# EAGLE design SparkFun_Color_Sensor_OPT4048 (EAGLE 9.6.2)
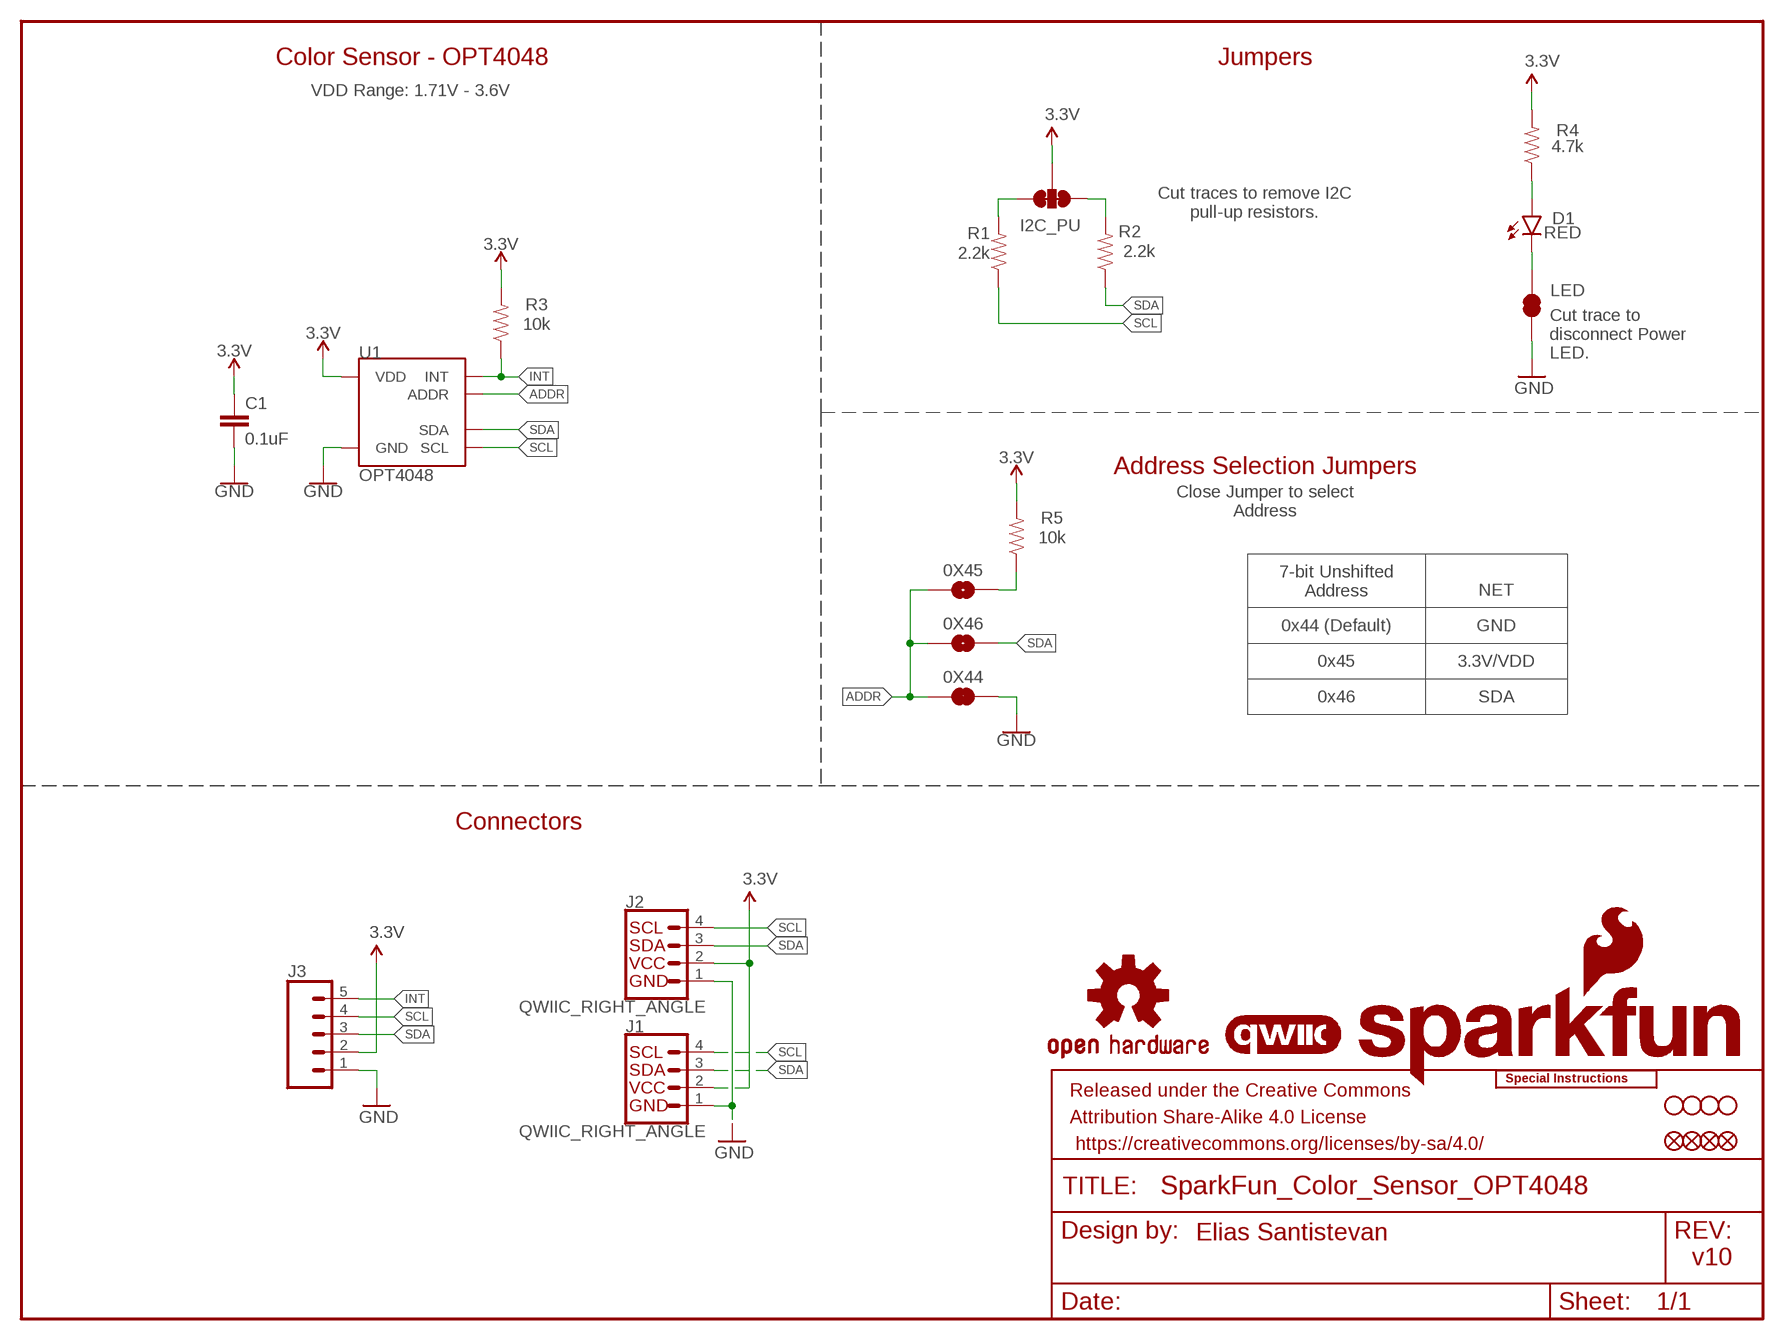
[diagram p0: schematic, sheet 1]

## Parts
0X44  JUMPER-SMT_2_NC_TRACE_SILK  [SMT-JUMPER_2_NC_TRACE_SILK]
0X45  JUMPER-SMT_2_NO_SILK  [SMT-JUMPER_2_NO_SILK]
0X46  JUMPER-SMT_2_NO_SILK  [SMT-JUMPER_2_NO_SILK]
C1  0.1uF  0.1UF-0402T-16V-10%  [0402-TIGHT]
D1  RED  LED-RED_0603-KB  [LED-0603]
FD1  FIDUCIALUFIDUCIAL  [FIDUCIAL-MICRO]
FD2  FIDUCIALUFIDUCIAL  [FIDUCIAL-MICRO]
FID1  FIDUCIALUFIDUCIAL  [FIDUCIAL-MICRO]
FID2  FIDUCIALUFIDUCIAL  [FIDUCIAL-MICRO]
FRAME1  FRAME-LETTER  [CREATIVE_COMMONS]
I2C_PU  S_MODE  JUMPER-SMT_3_2-NC_TRACE_SILK  [SMT-JUMPER_3_2-NC_TRACE_SILK]
J1  QWIIC_RIGHT_ANGLE  QWIIC_CONNECTORJS-1MM  [JST04_1MM_RA]
J2  QWIIC_RIGHT_ANGLE  QWIIC_CONNECTORJS-1MM  [JST04_1MM_RA]
J3  CONN_05NO_SILK  [1X05_NO_SILK]
LED  JUMPER-SMT_2_NC_TRACE_SILK  [SMT-JUMPER_2_NC_TRACE_SILK]
LOGO1  QWIIC_LOGO_4MM  [QWIIC_4MM]
LOGO2  OSHW-LOGOMINI  [OSHW-LOGO-MINI]
LOGO3  SFE_LOGO_NAME_FLAME.1_INCH  [SFE_LOGO_NAME_FLAME_.1]
LOGO4  SPECIAL_INSTRUCTIONS-ORDERING  [ORDERING_INSTRUCTIONS]
R1  2.2k  2.2KOHM-0603-1/10W-1%  [0603]
R2  2.2k  2.2KOHM-0603-1/10W-1%  [0603]
R3  10k  10KOHM-0603-1/10W-1%  [0603]
R4  4.7k  4.7KOHM-0603-1/10W-1%  [0603]
R5  10k  10KOHM-0603-1/10W-1%  [0603]
STANDOFF1  STAND-OFFTIGHT  [STAND-OFF-TIGHT]
STANDOFF2  STAND-OFFTIGHT  [STAND-OFF-TIGHT]
STANDOFF3  STAND-OFFTIGHT  [STAND-OFF-TIGHT]
STANDOFF4  STAND-OFFTIGHT  [STAND-OFF-TIGHT]
U1  OPT4048  [FCSOT]

## Nets
3.3V: C1.1 I2C_PU.2 J1.2 J2.2 J3.2 R3.2 R4.2 R5.2 U1.P1(VDD)
ADDR: 0X44.1 0X45.1 0X46.1 U1.P2(ADDR)
GND: 0X44.2 C1.2 J1.1 J2.1 J3.1 LED.1 U1.P4(GND)
INT: J3.5 R3.1 U1.P7(INT)
N$2: D1.A R4.1
N$3: D1.C LED.2
N$4: 0X45.2 R5.1
N$5: I2C_PU.1 R1.2
N$6: I2C_PU.3 R2.2
SCL: J1.4 J2.4 J3.4 R1.1 U1.P5(SCL)
SDA: 0X46.2 J1.3 J2.3 J3.3 R2.1 U1.P8(SDA)

## Notes on the sheet
- Color Sensor - OPT4048 | Jumpers
- VDD Range: 1.71V - 3.6V
- Cut traces to remove I2C
  pull-up resistors.
- Cut trace to
  disconnect Power
  LED.
- Address Selection Jumpers
- Close Jumper to select
  Address
- 7-bit Unshifted
  Address
- NET
- 0x44 (Default) | GND
- 0x45 | 3.3V/VDD
- 0x46 | SDA
- Connectors
- Elias Santistevan
- v10

## Library data of the parts
0X44 LED = SparkFun-Jumpers:JUMPER-SMT_2_NC_TRACE: Normally closed trace jumper This jumper has a trace between two pads so it's normally closed (NC). Use a razor knife to open the connection. For best results follow the IPC guidelines for cutting traces: Cutout at least 0.063 mm (0.005 in). Remove all loose material to clean up the cut area. Seal the cut with an approved epoxy. Reapply solder to reclose the connection.
0X45 0X46 = SparkFun-Jumpers:JUMPER-SMT_2_NO: Normally open jumper This jumper has two pads in close proximity to each other. Apply solder to close the connection. Round pads are easier to solder for beginners, but are a lot larger. SparkFun Product that uses the round pads: SparkFun EL Sequencer <https://www.sparkfun.com/products/12781>
C1 = SparkFun-Capacitors:0.1UF: 0.1µF ceramic capacitors A capacitor is a passive two-terminal electrical component used to store electrical energy temporarily in an electric field.; PROD_ID: CAP-12416
D1 = SparkFun-LED:LED-RED: Red SMD LED Used in manufacturing of most products at SparkFun Packages: 0603 - KB - KingBright (DIO-17976) SMD 0603 package [Datasheet] <https://www.kingbrightusa.com/images/catalog/SPEC/APT1608SURCK.pdf> 0603 - (DIO-00819, has gone EOL) SMD 0603 package 0603 SMART - SMD 0603 SMART package ( more efficient and expensive)[Product Link] <http://www.osram-os.com/Graphics/XPic2/00077099_0.pdf> 1206 - SMD1206 package [Product Link] <https://www.sparkfun.com/datasheets/DevTools/LilyPad/Q150OVS4.pdff> SparkFun Products: Pro Mini 328 -5V <https://www.sparkfun.com/products/821> RedBoard <https://www.sparkfun.com/products/12757> IOIO-OTG <https://www.sparkfun.com/products/13613>; PROD_ID: DIO-17976
FD1 FD2 FID1 FID2 = SparkFun-Aesthetics:FIDUCIAL: Fiducial Alignment Points Point-of-reference for pick-and-place machines and other optical instruments.
FRAME1 = SparkFun-Aesthetics:FRAME-LETTER: Schematic Frame - Letter Standard 8.5x11 US Letter frame; DESIGNER: Elias Santistevan
I2C_PU = SparkFun-Jumpers:JUMPER-SMT_3_2-NC_TRACE: Normally closed trace jumper (2 of 2 connections) This jumper has a trace between all three pads so they are normally closed (NC). Use a razor knife to open the connection(s). For best results follow the IPC guidelines for cutting traces: Cutout at least 0.063 mm (0.005 in). Remove all loose material to clean up the cut area. Seal the cut with an approved epoxy. Reapply solder to reclose the connection(s).
J1 J2 = SparkFun-Connectors:QWIIC_CONNECTOR: SparkFun I2C Standard Qwiic Connector An SMD 1mm pitch JST connector makes it easy and quick (get it? Qwiic?) to connect I2C devices to each other. The Qwiic system <http://www.sparkfun.com/qwiic> enables fast and solderless connection between popular platforms and various sensors and actuators. We carry 200mm <https://www.sparkfun.com/products/14204>, 100mm <https://www.sparkfun.com/products/14205>, 50mm <https://www.sparkfun.com/products/14206>, and breadboard friendly <https://www.sparkfun.com/products/14207> Qwiic cables. We also offer 10 pcs strips <https://www.sparkfun.com/products/14323> the SMD connectors.; PROD_ID: CONN-13694
J3 = SparkFun-Connectors:CONN_05: Multi connection point. Often used as Generic Header-pin footprint for 0.1 inch spaced/style header connections On any of the 0.1 inch spaced packages, you can populate with these: Break Away Headers - Straight <https://www.sparkfun.com/products/116> (PRT-00116) Break Away Male Headers - Right Angle <https://www.sparkfun.com/products/553> (PRT-00553) Female Headers <https://www.sparkfun.com/products/115> (PRT-00115) Break Away Headers - Machine Pin <https://www.sparkfun.com/products/117> (PRT-00117) Break Away Female Headers - Swiss Machine Pin <https://www.sparkfun.com/products/743> (PRT-00743) For SCREWTERMINALS and SPRING TERMINALS visit here: Screw Terimnals on SparkFun.com <https://www.sparkfun.com/search/results?term=Screw+Terminals> (5mm/3.5mm/2.54mm spacing) This device is also useful as a general connection point to wire up your design to another part of your project. Our various solder wires solder well into these plated through hole pads. Hook-Up Wire - Assortment (Stranded, 22 AWG) <https://www.sparkfun.com/products/11375> (PRT-11375) Hook-Up Wire - Assortment (Solid Core, 22 AWG) <https://www.sparkfun.com/products/11367> (PRT-11367) View the entire wire category on our website here <https://www.sparkfun.com/categories/141> Special notes: Molex polarized connector foot print use with SKU : PRT-08231 with associated crimp pins and housings. 1MM SMD Version SKU: PRT-10208
LOGO1 = SparkFun-Aesthetics:QWIIC_LOGO: Qwiic Logos for placement on schematic and PCB. The 5.5mm silk logo is best for placing next to Qwiic connector.
LOGO2 = SparkFun-Aesthetics:OSHW-LOGO: Open-Source Hardware (OSHW) Logo This logo indicates the piece of hardware it is found on incorporates a OSHW license and/or adheres to the definition of open source hardware found here: http://freedomdefined.org/OSHW
LOGO3 = SparkFun-Aesthetics:SFE_LOGO_NAME_FLAME: SparkFun Font Logo w/ Flame This is the SparkFun full logo. The logo on the schematic will always be the same size; the package variant is the height of the flame part of the logo. Default layer for the logo on the board is tSilk.
LOGO4 = SparkFun-Aesthetics:SPECIAL_INSTRUCTIONS: Special Ordering/Production Instructions Alert Symbol for special PCB ordering instructions or unique production process warnings. Ordering Instructions Production Instructions Types of information that should be added to box: Copper weight Soldermask color Silk color PCB thickness Number of layers PCB Standard: 1.6mm FR4 1 oz copper immersion silver plating red soldermask white silkscreen Types of information that should be added to box: Special wash requirements Depaneling instructions Humidification Glue curing Default text settings: 0.07 inch 9% ratio 50% line distance
R1 R2 = SparkFun-Resistors:2.2KOHM: 2.2kΩ resistor A resistor is a passive two-terminal electrical component that implements electrical resistance as a circuit element. Resistors act to reduce current flow, and, at the same time, act to lower voltage levels within circuits. - Wikipedia; PROD_ID: RES-08272
R3 R5 = SparkFun-Resistors:10KOHM: 10kΩ resistor A resistor is a passive two-terminal electrical component that implements electrical resistance as a circuit element. Resistors act to reduce current flow, and, at the same time, act to lower voltage levels within circuits. - Wikipedia; PROD_ID: RES-00824
R4 = SparkFun-Resistors:4.7KOHM: 4.7kΩ resistor A resistor is a passive two-terminal electrical component that implements electrical resistance as a circuit element. Resistors act to reduce current flow, and, at the same time, act to lower voltage levels within circuits. - Wikipedia; PROD_ID: RES-07857
STANDOFF1-STANDOFF4 = SparkFun-Hardware:STAND-OFF: Stand Off Drill holes for mechanically mounting via screws, standoffs, etc. Note: Use the keepout ring to avoid running the screw head into surrounding components. Variant Overviews STAND-OFF - Mechanical footprint for a #4 phillips button head screw. STAND-OFF-TIGHT - Mechanical footprint for a #4 phillips button head screw, Example SparkFun Products Screw - Phillips Head (1/4", 4-40, 10 pack) <https://www.sparkfun.com/products/10453> (PRT-10453) Screw - Phillips Head (1/2", 4-40, 10 pack) <https://www.sparkfun.com/products/10452> (PRT-10452) Screw - Phillips Head (3/4", 4-40, 10 pack) <https://www.sparkfun.com/products/10451> (PRT-10451) Screw - Phillips Head (1", 4-40, 10 pack) <https://www.sparkfun.com/products/10450> (PRT-10450)
U1 = Color_Sensor:OPT4048: Texas Instruments - OPT4048 Tristiumulus XYZ Color Sensor The OPT4048 is a single-chip high resolution color sensor, capable of measuring four channels each with specific engineered spectral responses. Three of the four channels closely match the CIE tristimulus spectra with the fourth channel having a wide band spectral response. With measurements from these channels, important characteristics of the lighting environment can be extracted like (i) light intensity (lux), (ii) color in CIE XY, LUV coordinates and (iii) Correlated Color Temperature. The OPT4048 is available in a small SOT-5X3 package.; PROD_ID: IC-18868

## Board
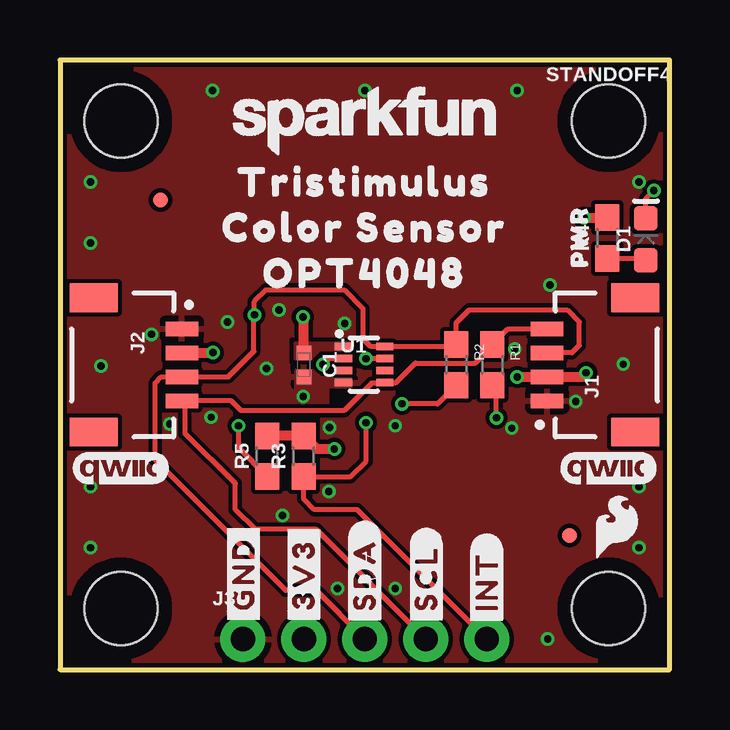
[diagram p1: board, top side]
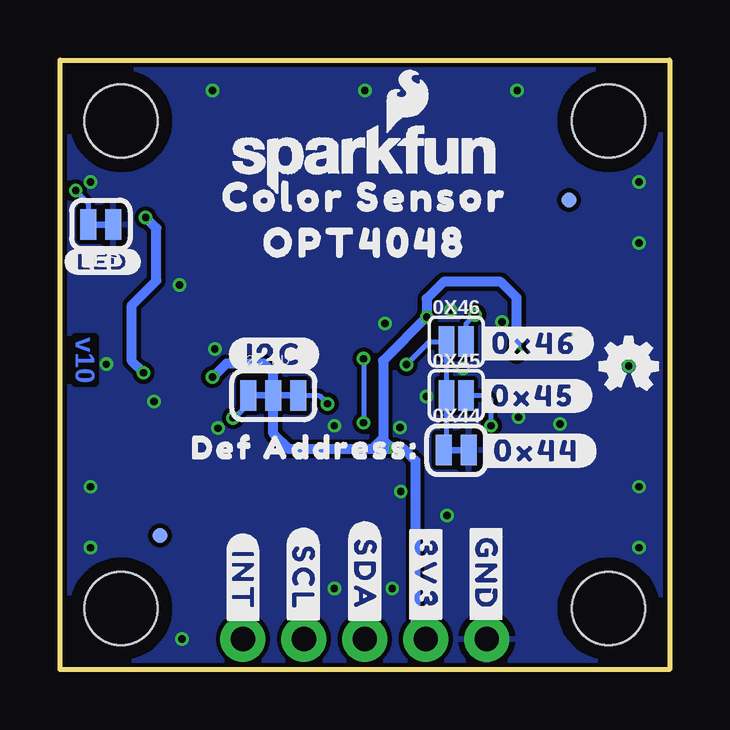
[diagram p2: board, bottom side, seen from below]

Size 25.4 x 25.4 mm. Coordinates in mm from the lower left corner, seen from the top.
Outline: 25.4,25.4 0,25.4 0,0 25.4,0 25.4,25.4
Copper layers (1*16): Top 0.035mm / dielectric 1.5mm / Bottom 0.035mm
Design rules "SparkFun-2-Layer-Minimum-JLCPCB": minimum track width 5mil, minimum drill 0.3mm, track to track 5mil, track to pad 5mil, pad to pad 5mil, via to via 5mil, smd to smd 5mil, copper to edge 7mil, drill to drill 7mil, minimum pad ring 5mil, minimum via ring 5mil, stop-mask expansion 2.5mil, vias tented up to drill 25mil, thermal gap 10mil
tRestrict: area 11.4,11.2 to 11.8,11.6

### Footprints (pad centres in the part's own frame; a part is rotated, then mirrored left to right if it is on the bottom)
SMT-JUMPER_2_NC_TRACE_SILK = smd 0.66 x 1.27: 1 -0.521,0; 2 0.521,0
SMT-JUMPER_2_NO_SILK = smd 0.635 x 1.27: 1 -0.406,0; 2 0.406,0
0402-TIGHT = smd 0.6 x 0.6: 1 -0.5,0; 2 0.5,0
LED-0603 = smd 1 x 1: A -0.877,0; C 0.877,0
FIDUCIAL-MICRO = smd 0.635 x 0.635: 1 0,0
SMT-JUMPER_3_2-NC_TRACE_SILK = smd 0.66 x 1.27: 1 -1.041,0; 2 0,0; 3 1.041,0
JST04_1MM_RA = smd 0.6 x 1.35: 1 -1.5,0; 2 -0.5,0; 3 0.5,0; 4 1.5,0 | smd 1.2 x 2: NC1 2.8,-3.675; NC2 -2.8,-3.675
1X05_NO_SILK = drill 1.016 pad 1.88: 1 0,0; 2 2.54,0; 3 5.08,0; 4 7.62,0; 5 10.16,0
0603 = smd 1.1 x 1: 1 -0.85,0; 2 0.85,0
STAND-OFF-TIGHT = hole 3.048: 0,0
FCSOT = smd 0.72 x 0.3: P1 -0.889,0.762; P2 -0.889,0.262; P3 -0.889,-0.238; P4 -0.889,-0.738; P5 0.831,-0.738; P6 0.831,-0.238; P7 0.831,0.262; P8 0.831,0.762

### Placement (x,y rotation side)
0X44  8.89,9.14 0 bottom
0X45  8.89,11.43 0 bottom
0X46  8.89,13.67 0 bottom
C1  10.16,12.7 270 top
D1  24.41,17.93 90 top
FD1  4.19,19.56 0 bottom
FD2  21.23,5.59 0 bottom
FID1  4.19,19.56 0 top
FID2  21.23,5.59 0 top
FRAME1  -19.05,-20.32 0 top  (outside the outline)
I2C_PU  16.51,11.43 0 bottom
J1  20.29,12.7 90 top
J2  5.08,12.7 270 top
J3  7.62,1.27 0 top
LED  23.7,18.54 180 bottom
LOGO1  22.86,8.38 0 top
LOGO2  1.7,12.65 0 bottom
LOGO3  12.66,21.28 0 bottom
LOGO4  29.21,50.8 0 top  (outside the outline)
LOGO5  QWIIC_LOGO_4MM  [QWIIC_4MM]  2.54,8.38 0 top
R1  18.01,12.7 270 top
R2  16.51,12.7 270 top
R3  10.16,8.89 90 top
R4  22.81,17.98 90 top
R5  8.64,8.89 90 top
STANDOFF1  2.54,22.86 0 top
STANDOFF2  2.54,2.54 0 top
STANDOFF3  22.86,2.54 0 top
STANDOFF4  22.86,22.86 0 top
U1  12.7,12.7 0 top
U$1  [#3V3#1]  10.16,3.96 90 top
U$2  [#GND#0]  7.65,3.99 90 top
U$3  [#SDA#1]  12.7,3.94 270 bottom
U$4  [#SDA#4]  12.7,3.96 90 top
U$5  [#SCL#5]  15.27,3.81 90 top
U$6  [#INT#3]  17.78,3.68 270 bottom
U$7  [#INT#9]  17.78,3.68 90 top
U$8  [#0X44#18]  5.54,9.12 0 bottom
U$9  [COLOR_SENSOR227]  12.7,19.68 0 bottom
U$10  [#I2C#227]  16.48,13.13 0 bottom
U$11  [#0X45#18]  5.69,11.4 0 bottom
U$12  [COLOR_SENSOR227]  12.7,18.41 0 top
U$13  [TRISTIMULUS228]  12.7,20.32 0 top
U$14  [OPT4048229]  12.7,16.51 0 top
U$15  [#3V3#1]  10.16,3.96 270 bottom
U$16  [#LED#11]  23.62,16.99 0 bottom
U$17  [#GND#0]  7.65,3.99 270 bottom
U$18  [SFE_LOGO_NAME_.1]  12.7,22.86 0 top
U$19  [OPT4048229]  12.7,17.78 0 bottom
U$20  [DEF_ADDRESS#_17]  15.01,9.25 0 bottom
U$21  [#0X46#18]  5.64,13.59 0 bottom
U$22  [#SCL#5]  15.27,3.81 270 bottom
U$28  [PWR8]  21.64,18.03 90 top
U$29  [SFE_LOGO_FLAME_.1]  23.19,5.97 0 top

### Tracks (layer width: path | path; a pad name or v marks a point on that pad's centre or on a via)
3.3V  (via drill 0.3)
  Top 0.406: J2.2 6.37,13.2 v6.38,13.21 | v19.05,12.19 v19.06,12.2 J1.2 21.75,12.2 v21.92,12.37 | v21.83,18.83 R4.2 | v11.43,9.2 10.71,9.2 R3.2 R5.2 | v10.12,14.69 10.16,14.69 C1.1
  Bottom 0.406: 12.39,9.2 15.88,9.2 16.51,9.83 I2C_PU.2 16.51,12.37 16.89,12.75 18.47,12.75 19.02,12.19 v19.05,12.19 | 12.39,9.2 11.94,9.2 | 11.94,9.2 v11.43,9.2 | v11.43,9.2 11.07,9.2 10.59,8.71 10.59,1.7 J3.2 | v21.92,12.37 22.4,12.85 22.4,15.19 21.39,16.2 21.39,18.39 v21.83,18.83 | v6.38,13.21 6.38,15.49 7.04,16.15 9.42,16.15 10.12,15.45 v10.12,14.69 11.94,12.88 11.94,9.65 | 11.94,9.65 11.94,9.53 | 11.94,9.53 11.94,9.2 | v11.43,9.2 11.56,9.2 11.89,9.53 11.94,9.53 | 12.39,9.2 11.94,9.65
  pour Top (no thermals): 12.17,13.59 9.78,13.59 9.78,12.95 10.46,12.95 10.85,13.34 12.17,13.34
ADDR  (via drill 0.3)
  Top 0.203: U1.P2 11.22,12.96 v10.96,12.71
  Bottom 0.203: v10.96,12.71 10.01,13.66 0X46.1 0X45.1 9.3,9.26 0X44.1
GND  (via drill 0.3)
  other vias: 10.13,11.38 18.95,13.36 11.86,14.43 13.97,10.16 1.27,20.32 1.27,17.78 1.7,12.65 1.27,7.62 1.27,5.08 6.35,24.13 12.7,24.13 19.05,24.13 23.47,12.73 24.13,7.62 24.13,5.08 24.13,20.32 6.3,10.52 21.49,11.18 4.57,10.24 20.42,16.03 3.81,13.97 6.99,14.48 11.23,10.08 11.2,7.42 11.56,3.38 9.27,6.43 13.97,3.38 20.32,1.27 18.82,10.06 9.12,14.99 8.61,12.55
  pour Bottom (isolate 0.178): 25.4,0 25.4,25.4 0,25.4 0,0
  pour Top (isolate 0.178, rank 2): 25.4,0 25.4,25.4 0,25.4 0,0
  pour Top (no thermals): 12.14,12.09 10.95,12.09 10.59,12.45 9.8,12.45 9.8,11.58 10.82,11.58 11.02,11.79 12.14,11.79
INT  (via drill 0.3)
  Top 0.203: U1.P7 12.76,12.96 v12.75,12.95 | v12.75,10.29 12.75,8.69 12.1,8.04 R3.1 10.16,7.11 10.6,6.67 11.49,6.67 12.38,6.67 J3.5
  Bottom 0.203: v12.75,12.95 v12.75,10.29
N$2
  Top 0.203: R4.1 24.33,17.13 D1.A
N$3  (via drill 0.3)
  Top 0.203: D1.C 24.41,19.63 v24.74,19.96
  Bottom 0.203: v24.74,19.96 24.22,19.44 LED.2
N$4  (via drill 0.3)
  Top 0.203: R5.1 7.44,9.23 v7.44,10.16
  Bottom 0.203: 0X45.2 7.63,11.43 7.44,11.25 v7.44,10.16
N$5  (via drill 0.3)
  Top 0.203: v18.19,10.49 18.19,11.67 R1.2
  Bottom 0.203: v18.19,10.49 18.11,10.49 17.55,11.05 I2C_PU.1
N$6  (via drill 0.3)
  Top 0.203: R2.2 15.73,11.07 v14.25,11.07
  Bottom 0.203: I2C_PU.3 14.61,11.43 v14.25,11.07
SCL
  Top 0.203: J1.4 18.66,14.2 R1.1 18.01,13.48 17.3,12.77 14.8,12.77 13.99,11.96 U1.P5 13.51,11.94 12.98,11.94 11.84,10.79 7.54,10.79 7.14,11.2 5.21,11.2 | 5.21,11.2 J2.4 | 5.21,11.2 5.21,9.86 7.3,7.76 7.3,6.67 8.13,5.84 10.67,5.84 J3.4
SDA  (via drill 0.3)
  Top 0.203: J1.3 21.33,13.2 21.64,13.51 21.64,14.48 21.13,14.99 17.05,14.99 16.51,14.45 R2.1 16.42,13.46 U1.P8 12.95,13.46 12.62,13.79 12.62,15.04 11.84,15.82 8.59,15.82 8.1,15.34 v8.1,14.78 8.08,14.76 8.08,13.26 7.02,12.2 J2.3 4.22,12.2 3.96,11.94 3.96,8.74 9.4,3.3 10.67,3.3 J3.3
  Bottom 0.203: 0X46.2 8.48,14.4 v8.1,14.78

### Text on the board
Bottom: v10
tDocu: 1.6mm Thickness / 1 oz. Copper / Lead-Free HASL finish / Material: TG135-140 / Red Soldermask / White Silkscreen